# EAGLE board mdu29 (EAGLE 8.6.0)
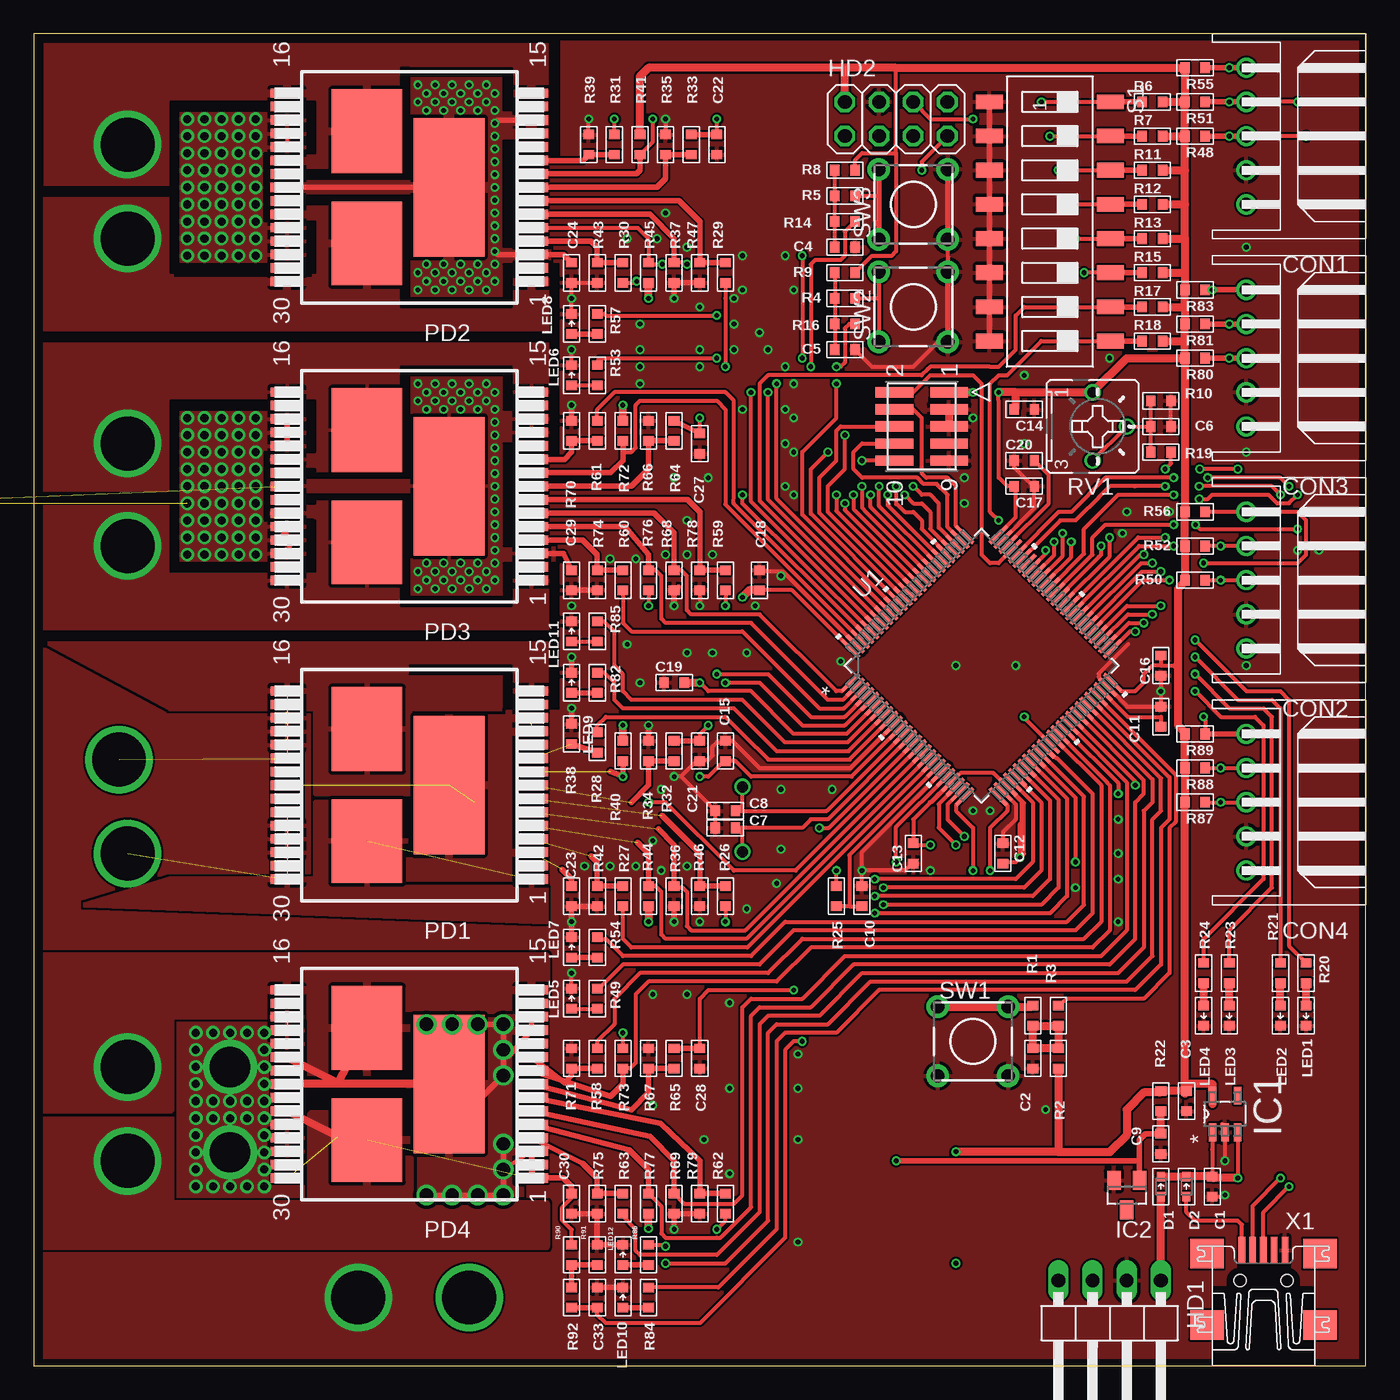
[diagram p3: board, top side]
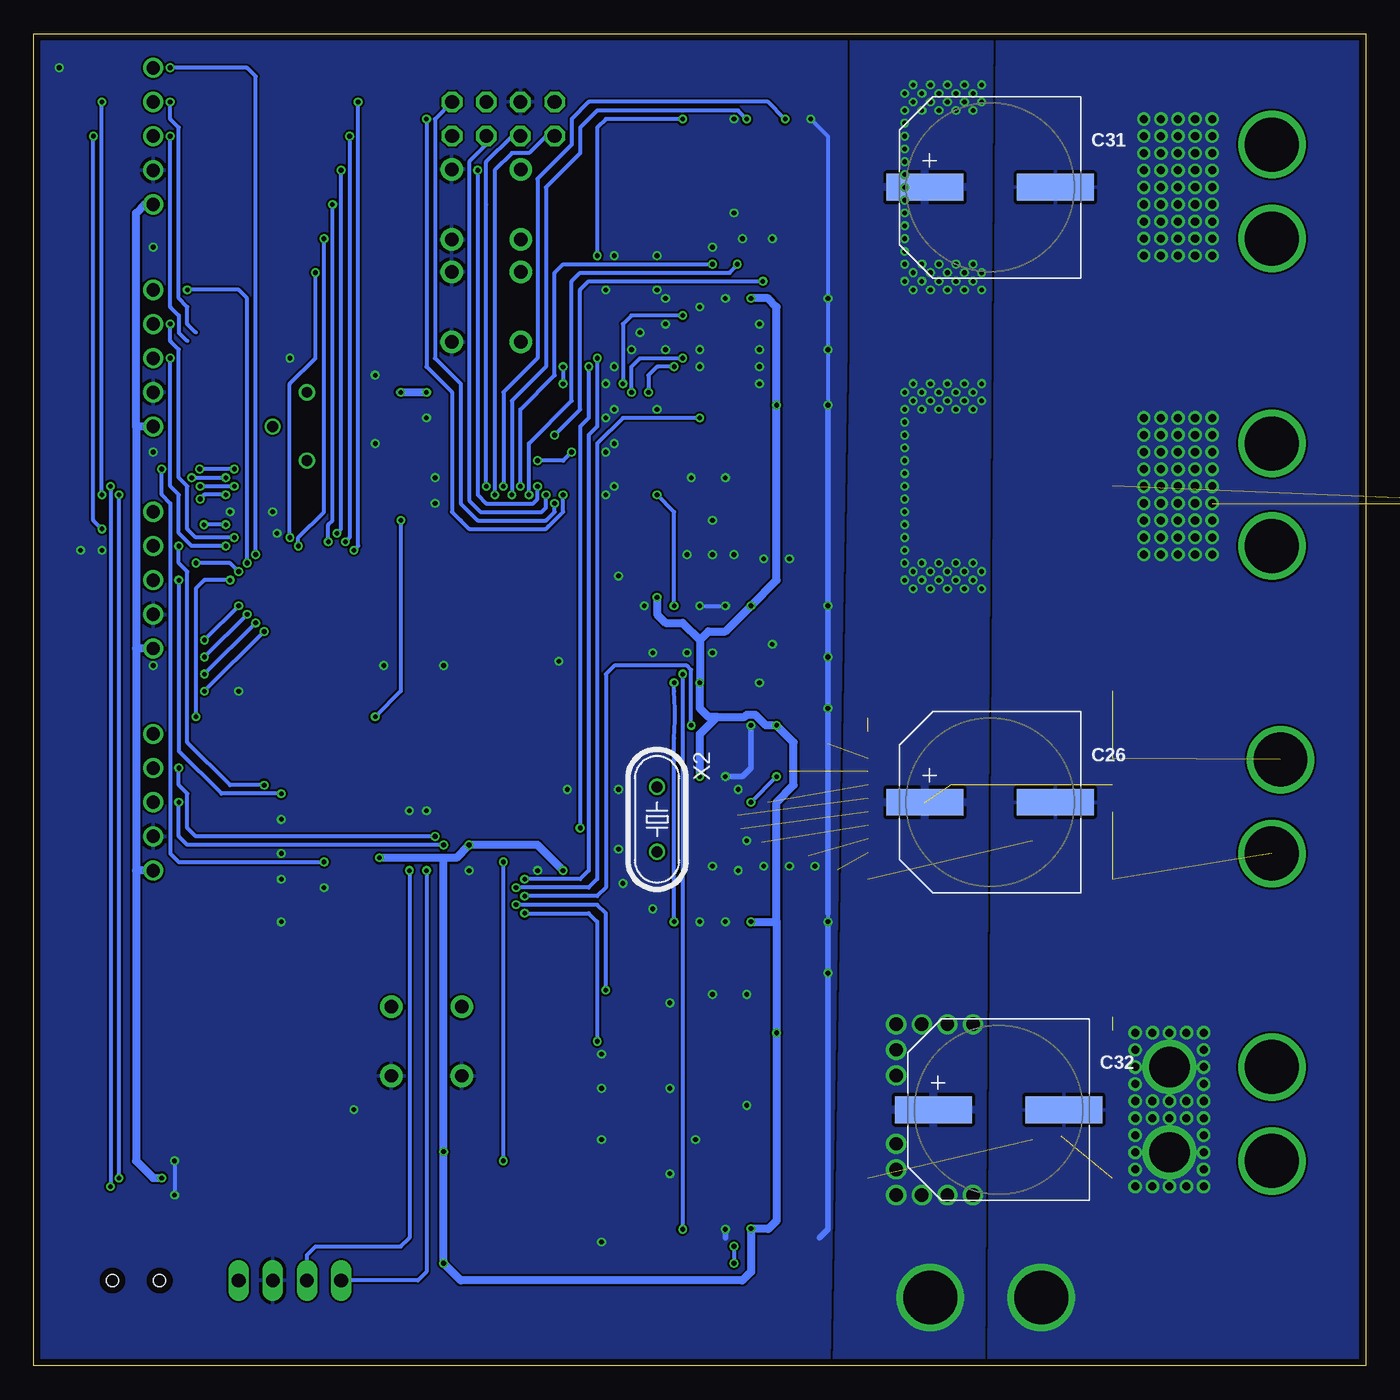
[diagram p4: board, bottom side, seen from below]

Size 99.06 x 99.06 mm. Coordinates in mm from the lower left corner, seen from the top.
Outline: 0,0 99.06,0 99.06,99.06 0,99.06 0,0
Copper layers (1*16): Top 0.035mm / dielectric 1.6mm / Bottom 0.035mm
Design rules "Elecrow_2-layer_PCB_eagle_rule": minimum track width 6mil, minimum drill 12mil, track to track 6mil, track to pad 6mil, pad to pad 6mil, via to via 8mil, smd to smd 0mil, copper to edge 20mil, drill to drill 10mil, minimum pad ring 6mil, minimum via ring 6mil, stop-mask expansion 0mil, vias tented up to drill 100mil, thermal gap 10mil
Net classes: 1 power: width 0.305 mm, drill 0.6 mm; 2 strong: width 0.406 mm, clearance 0.254 mm
tRestrict: area 0,81.3 to 21,94; area 17.1,85.1 to 27.9,96.5; area 0,87.6 to 39.1,99.1; area 34.9,83.2 to 39.1,93.3; area 0,0 to 39.1,87

## Footprints (pad centres in the part's own frame; a part is rotated, then mirrored left to right if it is on the bottom)
1608 = smd 0.7 x 0.8: 1 -0.75,0; 2 0.75,0
ES-12.5 = smd 5.7 x 2: N 4.85,0; P -4.85,0
5-L = drill 1: P$1 -5.08,0; P$2 -2.54,0; P$3 0,0; P$4 2.54,0; P$5 5.08,0
SOD523 = smd 0.7 x 0.6: A 0.75,0; K -0.75,0
1X4-L = drill 1.016 long: 1 -3.81,-3.81; 2 -1.27,-3.81; 3 1.27,-3.81; 4 3.81,-3.81
2X4-I = drill 1.016 octagon: 1 -3.81,-1.27; 2 -3.81,1.27; 3 -1.27,-1.27; 4 -1.27,1.27; 5 1.27,-1.27; 6 1.27,1.27; 7 3.81,-1.27; 8 3.81,1.27
SOT95P270X145-5N = smd 1.321 x 0.559: 1 -1.372,0.94; 2 -1.372,0; 3 -1.372,-0.94; 4 1.372,-0.94; 5 1.372,0.94
SOT23 = smd 1 x 1.4: 1 -0.95,-1.1; 2 0.95,-1.1; 3 0,1.1
CON10_2X5_DUK_FTSH = smd 0.762 x 2.794: 1 2.54,-2.032; 2 2.54,2.032; 3 1.27,-2.032; 4 1.27,2.032; 5 0,-2.032; 6 0,2.032; 7 -1.27,-2.032; 8 -1.27,2.032; 9 -2.54,-2.032; 10 -2.54,2.032
1608' = smd 0.7 x 0.8: A 0.75,0; K -0.75,0
VNH5019 = smd 2.4 x 0.7: 1 1.06,-1.89; 2 1.06,-2.89; 3 1.06,-3.89; 4 1.06,-4.89; 5 1.06,-5.89; 6 1.06,-6.89; 7 1.06,-7.89; 8 1.06,-8.89; 9 1.06,-9.89; 10 1.06,-10.89; 11 1.06,-11.89; 12 1.06,-12.89; 13 1.06,-13.89; 14 1.06,-14.89; 15 1.06,-15.89; 16 19.26,-15.89; 17 19.26,-14.89; 18 19.26,-13.89; 19 19.26,-12.89; 20 19.26,-11.89; 21 19.26,-10.89; 22 19.26,-9.89; 23 19.26,-8.89; 24 19.26,-7.89; 25 19.26,-6.89; 26 19.26,-5.89; 27 19.26,-4.89; 28 19.26,-3.89; 29 19.26,-2.89; 30 19.26,-1.89 | smd 5.25 x 6.23: OUTA#PAD 13.31,-4.725; OUTB#PAD 13.31,-13.055 | smd 5.25 x 10.3: VCC#PAD 7.21,-8.89
RV = drill 0.8: 1 -2.54,0; 2 0,2.54; 3 2.54,0
SMS-008 = smd 1.092 x 2.007: 1 -8.89,-4.496; 2 -6.35,-4.496; 3 -3.81,-4.496; 4 -1.27,-4.496; 5 1.27,-4.496; 6 3.81,-4.496; 7 6.35,-4.496; 8 8.89,-4.496; 9 8.89,4.496; 10 6.35,4.496; 11 3.81,4.496; 12 1.27,4.496; 13 -1.27,4.496; 14 -3.81,4.496; 15 -6.35,4.496; 16 -8.89,4.496
PUSHSW-1 = drill 1 pad 1.676: 1-1 -2.615,2.567; 1-2 2.615,2.567; 2-1 -2.615,-2.567; 2-2 2.615,-2.567
LQFP-100-M = smd 1.778 x 0.279: 1 -7.772,6; 2 -7.772,5.5; 3 -7.772,5; 4 -7.772,4.5; 5 -7.772,4; 6 -7.772,3.5; 7 -7.772,3; 8 -7.772,2.5; 9 -7.772,2; 10 -7.772,1.5; 11 -7.772,1; 12 -7.772,0.5; 13 -7.772,0; 14 -7.772,-0.5; 15 -7.772,-1; 16 -7.772,-1.5; 17 -7.772,-2; 18 -7.772,-2.5; 19 -7.772,-3; 20 -7.772,-3.5; 21 -7.772,-4; 22 -7.772,-4.5; 23 -7.772,-5; 24 -7.772,-5.5; 25 -7.772,-6; 51 7.772,-6; 52 7.772,-5.5; 53 7.772,-5; 54 7.772,-4.5; 55 7.772,-4; 56 7.772,-3.5; 57 7.772,-3; 58 7.772,-2.5; 59 7.772,-2; 60 7.772,-1.5; 61 7.772,-1; 62 7.772,-0.5; 63 7.772,0; 64 7.772,0.5; 65 7.772,1; 66 7.772,1.5; 67 7.772,2; 68 7.772,2.5; 69 7.772,3; 70 7.772,3.5; 71 7.772,4; 72 7.772,4.5; 73 7.772,5; 74 7.772,5.5; 75 7.772,6 | smd 0.279 x 1.778: 26 -6,-7.772; 27 -5.5,-7.772; 28 -5,-7.772; 29 -4.5,-7.772; 30 -4,-7.772; 31 -3.5,-7.772; 32 -3,-7.772; 33 -2.5,-7.772; 34 -2,-7.772; 35 -1.5,-7.772; 36 -1,-7.772; 37 -0.5,-7.772; 38 0,-7.772; 39 0.5,-7.772; 40 1,-7.772; 41 1.5,-7.772; 42 2,-7.772; 43 2.5,-7.772; 44 3,-7.772; 45 3.5,-7.772; 46 4,-7.772; 47 4.5,-7.772; 48 5,-7.772; 49 5.5,-7.772; 50 6,-7.772; 76 6,7.772; 77 5.5,7.772; 78 5,7.772; 79 4.5,7.772; 80 4,7.772; 81 3.5,7.772; 82 3,7.772; 83 2.5,7.772; 84 2,7.772; 85 1.5,7.772; 86 1,7.772; 87 0.5,7.772; 88 0,7.772; 89 -0.5,7.772; 90 -1,7.772; 91 -1.5,7.772; 92 -2,7.772; 93 -2.5,7.772; 94 -3,7.772; 95 -3.5,7.772; 96 -4,7.772; 97 -4.5,7.772; 98 -5,7.772; 99 -5.5,7.772; 100 -6,7.772
UX60-MB-5ST = smd 2 x 0.5: 1 2.25,1.6; 2 2.25,0.8; 3 2.25,0; 4 2.25,-0.8; 5 2.25,-1.6 | smd 2.2 x 2.5: M1 -3.3,-4.2; M2 -3.3,4.2; M3 2,4.2; M4 2,-4.2 | hole 0.9: 0,-1.75; 0,1.75
XTAL = drill 0.813: 1 -2.413,0; 2 2.413,0

## Placement (x,y rotation side)
C1  1uF  [1608]  87.63,13.34 270 top
C2  0.1uF  [1608]  74.3,22.86 90 top
C3  1uF  [1608]  85.72,19.68 270 top
C4  0.1uF  [1608]  60.33,83.19 180 top
C5  0.1uF  [1608]  60.33,75.56 180 top
C6  0.1uF  [1608]  83.82,69.85 180 top
C7  22p  [1608]  51.44,40.01 0 top
C8  22p  [1608]  51.44,41.27 0 top
C9  0.1uF  [1608]  83.82,16.51 90 top
C10  0.1uF  [1608]  61.59,34.92 270 top
C11  2.2uF  [1608]  83.82,48.26 270 top
C12  0.1uF  [1608]  72.07,38.1 270 top
C13  0.1uF  [1608]  65.41,38.1 90 top
C14  0.1uF  [1608]  73.66,71.12 180 top
C15  0.1uF  [1608]  51.44,45.72 270 top
C16  0.1uF  [1608]  83.82,52.07 90 top
C17  0.1uF  [1608]  73.66,65.41 180 top
C18  0.1uF  [1608]  53.98,58.42 270 top
C19  0.1uF  [1608]  47.62,50.8 0 top
C20  2.2uF  [1608]  73.66,67.31 0 top
C21  1000pF  [1608]  49.53,45.72 270 top
C22  1000pF  [1608]  50.8,90.81 270 top
C23  0.1uF  [1608]  40.01,34.92 270 top
C24  0.1uF  [1608]  40.01,81.28 270 top
C25  220uF  [ES-12.5]  -17.14,64.14 0 bottom  (outside the outline)
C26  220uF  [ES-12.5]  27.94,41.91 0 bottom
C27  1000pF  [1608]  49.53,68.58 270 top
C28  1000pF  [1608]  49.53,22.86 270 top
C29  0.1uF  [1608]  40.01,58.42 270 top
C30  0.1uF  [1608]  40.01,12.06 270 top
C31  220uF  [ES-12.5]  27.94,87.63 0 bottom
C32  220uF  [ES-12.5]  27.3,19.05 0 bottom
C33  1000pF  [1608]  41.91,5.08 90 top
CON1  [5-L]  90.17,91.44 90 top
CON2  [5-L]  90.17,58.42 90 top
CON3  [5-L]  90.17,74.93 90 top
CON4  [5-L]  90.17,41.91 90 top
D1  [SOD523]  83.82,13.34 270 top
D2  [SOD523]  85.72,13.34 270 top
HD1  [1X4-L]  80.01,2.54 180 top
HD2  [2X4-I]  64.14,92.71 0 top
IC1  MIC5504  [SOT95P270X145-5N]  88.58,18.73 90 top
IC2  LM4040  [SOT23]  81.28,12.7 180 top
J1  FTSH-105-01-L-DV-K-TR  [CON10_2X5_DUK_FTSH]  66.04,69.85 90 top
LED1  [1608']  94.61,26.04 90 top
LED2  [1608']  92.71,26.04 90 top
LED3  [1608']  88.9,26.04 90 top
LED4  [1608']  87,26.04 90 top
LED5  [1608']  40.01,27.3 270 top
LED6  [1608']  40.01,73.66 270 top
LED7  [1608']  40.01,31.11 270 top
LED8  [1608']  40.01,77.47 270 top
LED9  [1608']  40.01,50.8 270 top
LED10  [1608']  43.81,5.08 270 top
LED11  [1608']  40.01,54.61 270 top
LED12  [1608']  43.81,8.26 270 top
PD1  VNH5019  [VNH5019]  38.1,34.29 180 top
PD2  VNH5019  [VNH5019]  38.1,78.74 180 top
PD3  VNH5019  [VNH5019]  38.1,56.52 180 top
PD4  VNH5019  [VNH5019]  38.1,12.06 180 top
R1  330ohm  [1608]  74.3,26.04 270 top
R2  10k  [1608]  76.2,22.86 90 top
R3  1kohm  [1608]  76.2,26.04 90 top
R4  330ohm  [1608]  60.33,79.38 180 top
R5  330ohm  [1608]  60.33,87 180 top
R6  10k  [1608]  83.19,93.98 0 top
R7  10k  [1608]  83.19,91.44 0 top
R8  10k  [1608]  60.33,88.9 180 top
R9  10k  [1608]  60.33,81.28 180 top
R10  330  [1608]  83.82,71.75 0 top
R11  10k  [1608]  83.19,88.9 0 top
R12  10k  [1608]  83.19,86.36 0 top
R13  10k  [1608]  83.19,83.82 0 top
R14  1kohm  [1608]  60.33,85.09 0 top
R15  10k  [1608]  83.19,81.28 0 top
R16  1kohm  [1608]  60.33,77.47 0 top
R17  10k  [1608]  83.19,78.74 0 top
R18  10k  [1608]  83.19,76.2 0 top
R19  1kohm  [1608]  83.82,67.94 0 top
R20  330ohm  [1608]  94.61,29.21 90 top
R21  330ohm  [1608]  92.71,29.21 90 top
R22  100  [1608]  83.82,19.68 270 top
R23  330ohm  [1608]  88.9,29.21 90 top
R24  330ohm  [1608]  87,29.21 90 top
R25  100  [1608]  59.69,34.92 90 top
R26  10ohm  [1608]  51.44,34.92 90 top
R27  10ohm  [1608]  43.81,34.92 90 top
R28  10ohm  [1608]  41.91,46.35 270 top
R29  10ohm  [1608]  51.44,81.28 90 top
R30  10ohm  [1608]  43.81,81.28 90 top
R31  10ohm  [1608]  43.18,90.81 270 top
R32  3.9kohm  [1608]  47.62,45.72 90 top
R33  3.9kohm  [1608]  48.9,90.81 90 top
R34  820ohm  [1608]  45.72,45.72 270 top
R35  820ohm  [1608]  46.99,90.81 270 top
R36  47kohm  [1608]  47.62,34.92 90 top
R37  47kohm  [1608]  47.62,81.28 90 top
R38  47kohm  [1608]  40.01,46.99 270 top
R39  47kohm  [1608]  41.27,90.81 270 top
R40  47kohm  [1608]  43.81,45.72 90 top
R41  47kohm  [1608]  45.09,90.81 90 top
R42  47kohm  [1608]  41.91,34.92 90 top
R43  47kohm  [1608]  41.91,81.28 90 top
R44  47kohm  [1608]  45.72,34.92 270 top
R45  47kohm  [1608]  45.72,81.28 270 top
R46  47kohm  [1608]  49.53,34.92 90 top
R47  47kohm  [1608]  49.53,81.28 90 top
R48  10[khom]  [1608]  86.36,91.44 180 top
R49  330ohm  [1608]  41.91,27.3 90 top
R50  10[khom]  [1608]  86.36,58.42 180 top
R51  10kohm  [1608]  86.36,93.98 180 top
R52  10kohm  [1608]  86.36,60.96 180 top
R53  330ohm  [1608]  41.91,73.66 90 top
R54  330ohm  [1608]  41.91,31.11 90 top
R55  10kohm  [1608]  86.36,96.52 180 top
R56  10kohm  [1608]  86.36,63.5 180 top
R57  330ohm  [1608]  41.91,77.47 90 top
R58  10ohm  [1608]  41.91,22.86 270 top
R59  10ohm  [1608]  51.44,58.42 90 top
R60  10ohm  [1608]  43.81,58.42 90 top
R61  10ohm  [1608]  41.91,69.53 270 top
R62  10ohm  [1608]  51.44,12.06 90 top
R63  10ohm  [1608]  43.81,12.06 90 top
R64  3.9kohm  [1608]  47.62,69.53 90 top
R65  3.9kohm  [1608]  47.62,22.86 90 top
R66  820ohm  [1608]  45.72,69.53 270 top
R67  820ohm  [1608]  45.72,22.86 270 top
R68  47kohm  [1608]  47.62,58.42 90 top
R69  47kohm  [1608]  47.62,12.06 90 top
R70  47kohm  [1608]  40.01,69.53 270 top
R71  47kohm  [1608]  40.01,22.86 270 top
R72  47kohm  [1608]  43.81,69.53 90 top
R73  47kohm  [1608]  43.81,22.86 90 top
R74  47kohm  [1608]  41.91,58.42 90 top
R75  47kohm  [1608]  41.91,12.06 90 top
R76  47kohm  [1608]  45.72,58.42 270 top
R77  47kohm  [1608]  45.72,12.06 270 top
R78  47kohm  [1608]  49.53,58.42 90 top
R79  47kohm  [1608]  49.53,12.06 90 top
R80  10[khom]  [1608]  86.36,74.93 180 top
R81  10kohm  [1608]  86.36,77.47 180 top
R82  330  [1608]  41.91,50.8 90 top
R83  10kohm  [1608]  86.36,80.01 180 top
R84  330  [1608]  45.72,5.08 90 top
R85  330  [1608]  41.91,54.61 90 top
R86  330  [1608]  45.72,8.26 90 top
R87  10[khom]  [1608]  86.36,41.91 180 top
R88  10kohm  [1608]  86.36,44.45 180 top
R89  10kohm  [1608]  86.36,46.99 180 top
R90  11kohm  [1608]  40.01,8.26 90 top
R91  1kohm  [1608]  41.91,8.26 270 top
R92  3kohm  [1608]  40.01,5.08 90 top
RV1  10k B  [RV]  78.74,69.85 270 top
S1  SWS008  [SMS-008]  75.56,85.09 270 top
SW1  [PUSHSW-1]  69.85,24.13 0 top
SW2  [PUSHSW-1]  65.41,78.74 90 top
SW3  [PUSHSW-1]  65.41,86.36 90 top
U1  STM32F401VCT6LQFP-100-M  [LQFP-100-M]  70.48,52.07 45 top
X1  MINI-USB-UX60-MB-5ST  [UX60-MB-5ST]  91.44,6.35 90 top
X2  8MHz  [XTAL]  52.7,40.64 270 bottom

## Tracks (layer width: path | path; a pad name or v marks a point on that pad's centre or on a via)
+3V3  (via drill 0.35)
  Top 0.305: 87.64,19.48 IC1.5 | U1.50 80.88,50.16 81.92,50.16 82.55,50.8 82.55,51.44 83.19,52.07 83.82,52.07 | 83.7,52.7 C16.2 83.82,52.07 | 83.82,52.07 84.97,52.07 | 73.62,41.87 U1.28 72.38,43.11 72.32,43.11 | 73.62,41.87 73.66,41.82 | 67.19,42.42 67.32,42.54 | 67.32,42.54 U1.22 | U1.11 60.82,43.81 53.34,43.81 52.19,44.97 C15.2 51.32,44.97 50.16,43.81 v49.53,43.81 | 67.32,42.54 67.3,42.54 65.41,40.64 C13.2 65.52,38.73 v66.67,38.73 | R25.2 v59.69,36.83 | U1.75 73.03,63.09 73.03,65.29 C17.2 72.39,65.41 71.75,66.04 71.75,71.75 71.75,71.76 v71.75,72.39 | 60.96,89.02 R8.1 61.08,89.65 61.59,90.17 64.14,90.17 | C18.2 56.4,57.67 U1.100 | R76.2 v45.72,56.52 | U1.6 60.45,46.99 56.52,46.99 53.34,50.16 50.16,50.16 v49.53,50.8 | R73.2 v43.81,24.77 | C12.2 71.87,37.47 73.03,37.47 v73.34,37.78 | v73.34,37.78 73.66,38.1 73.62,38.14 73.62,41.87 | v73.34,37.78 73.34,40.31 73.48,40.45 73.48,41.94 72.32,43.11 | 66.63,41.91 66.75,41.91 68.91,44.07 71.35,44.07 72.32,43.11 | R9.1 62.34,82.55 63.82,82.55 64.14,82.87 64.14,90.17 | 64.14,90.17 64.14,96.52 | C3.1 85.61,20.32 85.61,20.23
  Top 0.61: R48.2 R51.2 | R51.2 R55.2 64.14,96.52 60.33,96.52 | R80.2 85.61,76.2 | 85.61,76.2 R81.2 85.61,78.74 | 85.61,78.74 R83.2 85.61,81.28 | 85.61,86.36 85.61,88.9 | 85.61,83.82 85.61,81.28 | 85.61,83.82 85.61,86.36 | 85.61,88.9 R48.2 | R80.2 R56.2 R52.2 R50.2 85.61,58.3 85.09,57.78 85.09,51.95 | R41.2 45.09,95.89 45.72,96.52 60.33,96.52 | R6.2 R51.2 | R7.2 R48.2 | R11.2 85.61,88.9 | R12.2 85.61,86.36 | R15.2 85.61,81.28 | R17.2 85.61,78.74 | R18.2 85.61,76.2 | R13.2 85.61,83.82 | 85.61,20.95 R87.2 R88.2 R89.2 85.61,47.1 85.09,47.62 85.09,51.95 | 85.61,20.23 85.61,20.95 | J1.1 v69.85,72.39 | 73.03,72.39 v71.75,72.39 | 73.03,72.39 RV1.1 81.28,74.93 R80.2 | HD2.2 60.33,96.52 | v45.72,79.38 R45.2 | R72.2 v43.81,71.44 | R40.2 v43.81,47.62 | R44.2 v45.72,33.02 | v45.72,10.21 R77.2 | C19.2 v49.53,50.8 | C18.2 53.23,57.67 v52.7,57.15 | C14.2 73.03,71.23 73.03,72.39 | 87.64,20.75 87.64,19.48 | IC1.5 87.64,20.95 85.61,20.95 | C3.1 R22.1 83.7,20.32 82.55,20.32 81.28,19.05 81.28,17.14 80.03,15.9 76.2,15.9 | v68.58,15.92 68.6,15.9 76.2,15.9 | R2.1 76.2,15.9 | 85.09,51.95 84.97,52.07
  Bottom 0.305: 68.58,37.78 67.63,37.78
  Bottom 0.61: v69.85,72.39 v71.75,72.39 71.84,72.39 | 43.81,33.02 v43.81,24.77 43.81,10.79 44.42,10.19 45.72,10.19 v45.72,10.21 45.72,6.99 46.35,6.35 67.31,6.35 v68.58,7.62 v68.58,15.92 68.58,37.78 | 43.81,33.02 43.81,41.91 42.55,43.18 42.55,46.35 v43.81,47.62 44.61,47.62 45.4,48.41 46.05,48.41 46.2,48.26 48.26,48.26 | v45.72,79.38 44.45,79.38 43.81,78.74 v43.81,71.44 43.81,58.42 v45.72,56.52 47.62,54.61 48.9,54.61 49.53,53.98 | v45.72,33.02 43.81,33.02 | 48.26,48.26 48.9,48.26 49.53,48.9 v49.53,50.8 49.53,53.98 | v52.7,57.15 52.7,55.88 52.07,55.24 50.8,55.24 49.53,53.98 | v59.69,36.83 61.59,38.73 v66.67,38.73 67.63,37.78 v73.34,37.78 | v49.53,43.81 49.53,46.99 48.26,48.26
+5V  (via drill 0.35)
  Top 0.305: IC1.1 87.63,16.09 C1.1 | IC1.3 89.52,13.98 v89.53,13.97
  Top 0.61: D1.K D2.K C1.1 87.75,13.97 v89.53,13.97
  Bottom 0.61: CON1.P$1 90.81,86.36 91.44,85.72 91.44,69.85 | CON4.P$1 91.44,36.83 | 91.44,69.85 91.44,53.34 | 91.44,53.34 91.44,36.83 | CON2.P$1 91.44,53.34 | CON3.P$1 91.44,69.85 | v89.53,13.97 90.17,13.97 91.44,15.24 91.44,36.83
A1  (via drill 0.35)
  Top 0.305: U1.88 59.05,63.5 59.05,65.41 60.33,66.67 v60.33,69.22 | R30.1 44.73,80.53 v44.84,80.64
  Bottom 0.305: 44.77,80.64 v44.84,80.64 57.78,80.64 58.42,80.01 58.42,71.12 v60.33,69.22
A2
  Top 0.305: R60.1 43.81,55.24 44.45,54.61 52.7,54.61 58.42,48.9 60.24,48.9 U1.3
A3
  Top 0.305: U1.18 53.07,31.11 44.45,31.11 43.81,31.75 R27.1
A4
  Top 0.305: U1.44 83.19,43.61 83.19,41.91 82.55,41.27 82.55,31.11 80.64,29.21 61.59,29.21 58.42,26.04 54.61,26.04 53.98,25.4 53.98,11.43 50.8,8.26 45.09,8.26 44.77,8.57 44.77,10.16 43.81,11.11 R63.1
B1  (via drill 0.35)
  Top 0.305: R31.1 v43.18,92.71 | v64.14,65.41 64.14,64.08 64.19,64.08 64.77,63.5 65.41,63.5 66.04,62.87 66.04,62.23 66.22,62.05 66.22,62.04 67.82,60.44 U1.80
  Bottom 0.305: v43.18,92.71 44.45,93.98 57.78,93.98 59.05,92.71 59.05,90.81 61.59,88.27 61.59,74.93 64.14,72.39 v64.14,65.41
B2
  Top 0.305: R61.1 41.91,71.12 43.18,72.39 51.44,72.39 52.07,71.75 52.07,64.77 52.06,64.14 U1.97
B3
  Top 0.305: R28.1 41.91,47.62 42.55,48.26 51.44,48.26 52.77,46.93 52.78,46.93 54.62,45.09 60.67,45.09 U1.9
B4
  Top 0.305: U1.38 79.38,43.18 79.38,33.02 78.11,31.75 57.15,31.75 54.61,29.21 45.09,29.21 43.18,27.3 43.18,25.4 41.91,24.13 R58.1
BATERR  (via drill 0.35)
  Top 0.305: U1.51 81.51,54.61 v81.92,54.61 | v86.36,50.16 88.27,48.26 90.81,48.26 91.44,47.62 91.44,36.2 87,31.75 R24.2
  Bottom 0.305: v81.92,54.61 v86.36,50.16
BATSTA  (via drill 0.35)
  Top 0.305: U1.52 81.44,55.24 v82.55,55.24 | v86.36,51.44 88.9,48.9 91.44,48.9 92.08,48.26 92.08,35.56 88.9,32.38 R23.2
  Bottom 0.305: v82.55,55.24 v86.36,51.44
BOOT0@SYS
  Top 0.305: 81.28,78.74 73.66,78.74 73.03,78.11 73.03,75.56 71.75,74.3 71.12,74.3 71.11,74.29 71.11,74.3 66.67,74.3 66.5,74.12 66.49,74.12 66.03,73.66 54.61,73.66 53.98,73.03 53.98,64.34 U1.94
  Top 0.406: R17.1 81.28,78.74 S1.10
BOOT1@SYS  (via drill 0.35)
  Top 0.305: v71.75,62.87 71.12,63.5 71.12,73.03 71.75,73.66 72.39,73.66 74.93,76.2 S1.9 | v73.66,48.26 73.66,48.19 U1.37
  Top 0.406: S1.9 R18.1
  Bottom 0.305: v71.75,62.87 71.75,50.16 v73.66,48.26
C1@ANA  (via drill 0.35)
  Top 0.305: C22.1 v50.8,92.71 | U1.29 74.3,41.9 74.3,37.47 73.03,36.2 v62.55,36.2 | v57.15,82.55 v57.15,74.93
  Top 0.406: R33.2 C22.1
  Bottom 0.305: v50.8,92.71 56.52,92.71 57.15,92.08 v57.15,82.55 | v62.55,36.2 58.42,36.2 57.78,36.83 57.78,69.22 57.15,69.85 v57.15,74.93
C2@ANA  (via drill 0.35)
  Top 0.305: C27.1 v49.53,70.48 | U1.30 73.15,43.69 74.93,41.91 74.93,36.83 73.66,35.56 v63.18,35.56
  Top 0.406: R64.2 C27.1
  Bottom 0.305: v49.53,70.48 55.24,70.48 57.15,68.58 57.15,36.2 57.78,35.56 v63.18,35.56
C3@ANA  (via drill 0.35)
  Top 0.305: 73.51,44.04 U1.31 75.56,42.04 75.56,36.2 74.3,34.92 v62.55,34.92 | C21.1 49.53,46.99 v50.16,47.62
  Top 0.406: R32.2 C21.1
  Bottom 0.305: v50.16,47.62 50.16,51.75 50.48,52.07 55.88,52.07 56.52,51.44 56.52,35.56 57.15,34.92 v62.55,34.92
C4@ANA  (via drill 0.35)
  Top 0.305: U1.32 76.2,42.11 76.2,35.56 74.93,34.29 v63.18,34.29 | C28.1 49.53,27.3 50.16,27.94 v56.52,27.94
  Top 0.406: R65.2 C28.1
  Bottom 0.305: v56.52,27.94 56.52,33.66 57.15,34.29 v63.18,34.29
CD1  (via drill 0.35)
  Top 0.305: 44.45,85.63 44.66,85.63 | U1.82 62.87,63.93 v62.87,65.41 | v48.58,81.92 48.46,82.03 R37.2
  Top 0.406: PD2.6 44.45,85.63 45.81,85.63 47.62,83.82 R37.2
  Bottom 0.305: v62.87,65.41 62.87,71.12 60.33,73.66 60.33,81.28 59.69,81.92 v48.58,81.92
CD2
  Top 0.305: U1.1 60.09,50.16 59.69,50.16 53.98,55.88 48.9,55.88 48.58,56.2 48.58,58.74 48.15,59.17 R68.2
  Top 0.406: PD3.6 46.13,63.41 47.62,61.91 R68.2
CD3  (1 unrouted)
  Top 0.305: U1.16 52.92,32.38 48.9,32.38 48.58,32.7 48.58,35.24 48.26,35.56 47.74,35.56 R36.2
  Top 0.406: 46.45,39.91 47.62,38.73 R36.2
CD4
  Top 0.305: R69.2 48.38,12.06 52.07,12.06 52.7,12.7 52.7,26.67 53.34,27.3 57.15,27.3 60.33,30.48 79.38,30.48 81.28,32.38 81.28,43.4 U1.41
  Top 0.406: PD4.6 45.81,17.05 47.62,15.24 R69.2
CLKIN
  Top 0.305: U1.12 58.98,41.27 52.7,41.27 | 52.7,41.27 X2.1 | C8.2 52.7,41.27
CLKOUT
  Top 0.305: X2.2 52.7,40.01 C7.2 57.15,40.01 57.78,40.64 59.05,40.64 U1.13
CTS2@UART  (via drill 0.35)
  Top 0.305: HD2.7 66.04,89.53 v66.04,88.9 | U1.84 61.88,63.5 61.59,63.82 v61.59,65.41
  Bottom 0.305: v66.04,88.9 66.04,64.77 65.41,64.14 61.91,64.14 61.59,64.45 v61.59,65.41
DM@USB  (via drill 0.35)
  Top 0.305: X1.2 90.64,11.9 v92.71,13.97 | v92.71,64.77 92.08,65.41 v86.68,65.41 | v84.14,65.41 81.92,65.41 | 81.92,65.41 81.86,65.4 | 81.92,65.41 80.01,65.41 79.2,64.59 79.2,64.58 77.66,63.04 77.65,63.04 77.47,62.87 76.33,62.87 U1.70
  Bottom 0.305: v86.68,65.41 v84.14,65.41 | v92.71,13.97 v92.71,64.77
DP@USB  (via drill 0.35)
  Top 0.305: X1.3 91.44,11.43 v93.34,13.34 | v93.34,65.41 92.71,66.04 v87.31,66.04 | v84.77,66.04 79.69,66.04 77.15,63.5 76.2,63.5 U1.71
  Bottom 0.305: v87.31,66.04 v84.77,66.04 | v93.34,65.41 v93.34,13.34
EA1  (via drill 0.35)
  Top 0.305: U1.83 62.23,63.86 v62.23,64.77 | v46.74,81.92 45.84,81.92 R45.1 45.72,83.82 44.91,84.63 PD2.5
  Bottom 0.305: v62.23,64.77 62.23,68.58 59.05,71.75 59.05,80.64 58.42,81.28 47.31,81.28 46.67,81.92 v46.74,81.92
EA2
  Top 0.305: U1.2 60.17,49.53 59.05,49.53 53.34,55.24 46.99,55.24 46.67,55.56 46.67,58.74 46.24,59.17 R76.1
  Top 0.406: PD3.5 43.96,62.41 45.72,60.33 R76.1
EA3  (1 unrouted)
  Top 0.305: U1.17 52.99,31.75 46.99,31.75 46.67,32.07 46.67,35.24 46.24,35.67 R44.1
  Top 0.406: R44.1 45.72,38.1 44.91,38.91
EA4
  Top 0.305: R77.1 46.67,11.86 46.67,9.84 46.99,9.53 50.79,9.53 51.06,9.53 53.34,11.81 53.34,26.04 53.98,26.67 57.78,26.67 60.96,29.84 80.01,29.84 81.92,31.75 81.92,41.91 82.55,42.55 82.55,43.54 U1.43
  Top 0.406: R77.1 45.72,14.61 44.27,16.05 PD4.5
EB1  (via drill 0.35)
  Top 0.305: R41.1 46.04,91.01 v46.04,92.71 | v63.5,64.77 63.5,64 U1.81
  Top 0.406: R41.1 45.09,88.9 44.81,88.63 PD2.9
  Bottom 0.305: v46.04,92.71 46.67,93.34 57.15,93.34 58.42,92.08 58.42,90.17 60.96,87.63 60.96,74.3 63.5,71.75 v63.5,64.77
EB2
  Top 0.305: 43.81,67.31 43.81,67.63 | R72.1 43.93,67.94 44.45,67.94 44.77,68.26 44.77,71.44 45.09,71.75 50.8,71.75 51.44,71.12 51.44,64.05 U1.98
  Top 0.406: R72.1 43.81,67.31 42.91,66.41 PD3.9
EB3  (via drill 0.35)  (1 unrouted)
  Top 0.305: U1.15 56.66,36.83 52.07,36.83 46.99,41.91 v45.72,41.91
  Top 0.406: R40.1 v43.81,43.81 42.91,44.18
  Bottom 0.305: v45.72,41.91 v43.81,43.81
EB4
  Top 0.305: U1.39 76.33,46.87 79.83,43.37 79.83,43.36 80.01,43.18 80.01,32.38 78.74,31.11 57.78,31.11 55.24,28.57 45.72,28.57 44.77,27.62 44.77,22.54 44.34,22.11 R73.1
  Top 0.406: PD4.9 42.91,20.05 43.81,20.95 R73.1
EIO0  (via drill 0.35)
  Top 0.305: v64.77,64.77 65.41,64.14 66.04,64.14 66.67,63.5 66.67,62.23 68.58,60.33 68.58,60.34 U1.79
  Bottom 0.305: HD2.1 60.96,91.44 62.23,90.17 63.5,90.17 64.77,88.9 v64.77,64.77
EIO1  (via drill 0.35)
  Top 0.305: U1.78 67.31,62.32 67.31,64.14 66.67,64.77 66.04,64.77 v65.41,65.41
  Bottom 0.305: HD2.3 63.5,91.44 65.41,89.53 65.41,86.36 v65.41,65.41
ENCL1  (via drill 0.35)
  Top 0.305: R57.2 42.43,78.22 42.55,78.11 v50.8,78.11 | U1.92 55.24,64.48 v55.24,73.03
  Bottom 0.305: v50.8,78.11 54.61,78.11 55.24,77.47 v55.24,73.03
ENCL2
  Top 0.305: U1.7 60.53,46.35 55.88,46.35 52.7,49.53 44.45,49.53 43.81,50.16 43.81,51.44 43.18,52.07 43.18,54.61 42.43,55.36 R85.2
ENCL3
  Top 0.305: R54.2 42.02,31.75 42.55,31.75 43.81,30.48 53.34,30.48 55.88,33.02 76.83,33.02 78.11,34.29 78.11,42.33 U1.35
ENCL4  (via drill 0.35)
  Top 0.305: R86.2 46.88,9.01 v46.99,8.89 | v46.99,7.62 51.44,7.62 54.61,10.79 54.61,24.77 55.24,25.4 59.05,25.4 62.23,28.57 81.28,28.57 83.19,30.48 83.19,40.64 83.82,41.27 83.82,43.69 U1.45
  Bottom 0.305: v46.99,8.89 v46.99,7.62
ERR1  (via drill 0.35)
  Top 0.305: R53.2 42.02,74.93 v50.8,74.93 | U1.93 54.61,64.41 v54.61,72.39
  Bottom 0.305: v54.61,72.39 54.61,74.3 53.98,74.93 v50.8,74.93
ERR2
  Top 0.305: U1.8 60.6,45.72 55.24,45.72 52.07,48.9 43.81,48.9 43.18,49.53 43.18,50.8 42.43,51.55 R82.2
ERR3
  Top 0.305: U1.36 75.33,45.87 76.01,45.19 76.1,45.19 78.74,42.55 78.74,33.66 77.47,32.38 56.52,32.38 53.98,29.84 43.81,29.84 42.02,28.05 R49.2
ERR4
  Top 0.305: U1.46 84.45,43.76 84.45,41.91 84.45,40.64 83.82,40.01 83.82,29.84 81.92,27.94 62.87,27.94 59.69,24.77 55.88,24.77 55.24,24.13 55.24,10.16 50.91,5.83 R84.2
GND  (via drill 0.35, 0.6 pad 1, 3 pad 1, 4)  (2 unrouted)
  Top 0.305: R39.1 v41.27,92.71 | v46.99,92.71 R35.1 | R43.1 C24.2 v40.01,79.38 LED8.K | v88.58,15.24 IC1.2 88.58,17.78 88.38,17.98 | v88.58,12.7 88.58,12.59 C1.2 | C18.1 53.98,59.05 55.72,59.05 U1.99 | U1.49 81.32,49.01 C11.1 v83.82,50.16 C16.1 | 80.69,49.71 79.19,51.2 79.19,51.47 81.39,53.67 | U1.20 61.59,38.23 v61.59,36.83 | U1.27 73.03,41.75 73.03,40.64 72.07,39.69 C12.1 | C10.1 v61.59,36.83 | U1.74 74.41,63.77 C17.1 74.3,65.41 72.91,66.79 C20.1 | C6.1 R10.2 | 67.97,83.82 67.97,82.58 67.94,82.55 67.97,82.52 67.97,80.64 | C5.1 62.34,74.3 65.41,74.3 67.23,76.12 SW2.2-1 | LED6.K v40.01,75.56 | R78.1 v49.53,56.52 | C7.1 C8.1 48.15,43.81 | U1.10 60.74,44.45 53.98,44.45 51.95,46.47 C15.1 51.32,46.35 50.8,46.35 50.48,46.04 50.48,45.4 50.16,45.09 49.65,45.09 C21.2 49.3,44.97 48.15,43.81 | LED5.K v40.01,29.21 | C13.1 65.29,37.35 64.77,36.83 v61.59,36.83 | 48.15,43.81 v47.62,43.81 | PD2.19 PD2.20
  Top 0.406: PD3.18 PD3.20 | 18.66,61.59 18.41,61.59 18.59,61.77 PD3.26 18.66,61.59 | 18.66,61.59 19.05,61.59 19.05,60.98 PD3.27 | S1.1 S1.2 S1.3 S1.4 S1.5 S1.6 S1.7 S1.8 | SW3.2-1 67.97,83.82 SW3.2-2 68.05,88.9 | SW2.2-1 67.97,80.64 SW2.2-2 | C30.2 R75.1 R91.1 LED12.K | R79.1 R69.1 v47.62,10.16 | R42.1 C23.2 v40.01,33.02 LED7.K | v47.62,33.02 R36.1 | C29.2 R74.1 | R47.1 R37.1 v47.62,79.38 | v47.62,56.52 R68.1 47.96,57.9 | R34.1 v45.72,47.62 | R38.1 v40.01,48.9 | v40.01,71.44 R70.1 | LED9.K v40.01,52.7 | LED10.K C33.2
  Top 0.61: J1.3 J1.5
  Bottom 0.305: v88.58,15.24 v88.58,12.7 | v40.01,71.44 v40.01,75.56 v40.01,79.38 40.01,91.44 v41.27,92.71 | 40.01,33.66 v40.01,33.02 | v49.53,56.52 v47.62,56.52
  Bottom 0.406: 47.62,9.53 v47.62,10.16 | v47.62,43.81 46.35,43.81 45.72,44.45 v45.72,47.62 | 40.01,33.66 v40.01,48.9 v40.01,52.7 v40.01,71.44 | 40.64,9.53 40.01,10.16 v40.01,29.21 v40.01,33.02
  other vias: 14.61,22.23 13.97,88.9 12.7,88.9 11.43,88.9 11.43,87.63 12.7,82.55 11.43,85.09 11.43,83.82 11.43,82.55 12.7,87.63 12.7,85.09 11.43,86.36 12.7,86.36 40.01,56.52 69.22,66.04 69.85,70.48 73.66,68.58 69.22,64.14 73.66,73.66 80.01,74.93 81.28,63.5 84.45,63.5 80.96,61.91 73.03,52.07 68.58,52.07 90.17,83.19 90.17,67.94 90.17,52.07 97.16,96.52 69.85,41.27 71.12,41.27 66.67,36.83 59.37,42.86 55.56,42.86 55.56,38.42 49.53,33.02 56.52,64.77 55.88,65.41 55.88,68.58 56.52,67.94 56.52,70.48 55.88,71.12 56.52,73.03 55.88,74.3 56.52,80.01 52.7,80.01 52.07,79.38 52.07,77.47 52.07,75.56 54.61,75.56 53.98,76.83 52.7,71.12 45.09,77.47 45.09,75.56 45.09,74.3 45.09,73.03 49.53,75.56 49.53,74.3 49.53,78.74 55.88,82.55 52.7,82.55 47.62,66.04 48.58,62.87 46.99,60.33 50.48,60.33 50.16,66.04 55.56,58.74 53.66,56.52 60.01,52.39 46.67,42.86 46.04,39.05 46.67,36.83 48.58,37.15 42.86,37.15 44.77,37.15 40.96,37.15 51.75,26.99 48.58,27.62 46.04,27.62 46.04,19.37 49.85,16.83 51.75,14.29 51.75,20.64 56.83,20.64 56.83,23.18 56.83,9.21 56.83,16.83 80.64,40.64 80.64,38.1 80.64,36.2 80.64,33.02 93.98,60.64 95.57,60.64 53.02,33.97 55.24,35.88 53.02,53.02 50.48,53.02 48.58,53.02 45.09,50.8 44.13,53.66 44.77,60.01 42.86,60.01 48.58,60.33 46.99,85.72 46.35,83.82 48.58,83.19 44.13,83.82 77.47,35.56 75.25,19.05 15.24,87.63 13.97,87.63 14.61,15.88 17.14,24.77 15.88,24.77 14.61,24.77 13.34,24.77 12.06,24.77 12.06,23.5 12.06,22.23 12.06,20.95 12.06,19.68 12.06,18.41 12.06,17.14 12.06,15.88 12.06,14.61 17.14,23.5 17.14,22.23 17.14,20.95 17.14,19.68 17.14,18.41 15.88,19.68 17.14,17.14 17.14,15.88 17.14,14.61 17.14,13.34 15.88,13.34 14.61,13.34 13.34,13.34 12.06,13.34 15.88,18.41 14.61,19.68 14.61,18.41 13.34,18.41 13.34,19.68 24.13,5.08 12.7,83.82 13.97,83.82 13.97,85.09 13.97,86.36 15.24,86.36 15.24,82.55 13.97,82.55 16.51,82.55 16.51,83.82 15.24,83.82 15.24,85.09 15.24,88.9 16.51,85.09 16.51,86.36 16.51,87.63 16.51,88.9 11.43,90.17 12.7,90.17 13.97,90.17 15.24,90.17 16.51,90.17 16.51,91.44 15.24,91.44 13.97,91.44 13.97,92.71 15.24,92.71 16.51,92.71 11.43,92.71 11.43,91.44 12.7,91.44 12.7,92.71 11.43,70.48 12.7,70.48 13.97,70.48 15.24,70.48 16.51,70.48 16.51,69.22 15.24,69.22 13.97,69.22 12.7,69.22 11.43,69.22 11.43,67.94 12.7,67.94 13.97,67.94 15.24,67.94 16.51,67.94 16.51,66.67 15.24,66.67 13.97,66.67 12.7,66.67 11.43,66.67 11.43,65.41 11.43,60.33 11.43,61.59 11.43,62.87 11.43,64.14 12.7,60.33 13.97,60.33 15.24,60.33 16.51,60.33 16.51,61.59 15.24,61.59 13.97,61.59 12.7,61.59 12.7,62.87 13.97,62.87 13.97,64.14 13.97,65.41 12.7,65.41 12.7,64.14 15.24,65.41 15.24,64.14 15.24,62.87 16.51,62.87 16.51,64.14 16.51,65.41
  pour Top (rank 6): -0.64,100.33 0,0 99.06,0 99.69,100.97
  pour Bottom (rank 6): 0,0 99.06,0 99.06,100.33 0,101.6
M1M  (via drill 4)
  other vias: 6.99,90.81
  pour Top (rank 3): 0.64,98.42 0.64,87.63 10.16,87.63 10.16,93.98 20.95,93.98 20.95,90.17 17.46,90.17 17.46,88.58 27.3,88.58 27.3,96.52 35.56,96.52 35.56,93.98 38.42,93.98 38.42,98.42
M1P  (via drill 4)
  other vias: 6.99,83.82
  pour Top (rank 2): 38.42,76.83 38.42,81.28 35.24,81.28 35.56,78.74 27.3,78.74 27.3,86.68 21.91,86.68 21.91,86.36 17.46,86.36 17.46,85.41 20.95,84.77 20.95,80.64 10.16,80.64 10.16,87 0.64,87 0.64,76.83
M2M  (via drill 4)
  other vias: 6.99,68.58
  pour Top (rank 3): 0.64,65.09 0.64,76.2 38.42,76.2 38.42,71.75 35.56,71.75 35.56,74.3 27.3,74.3 27.3,66.36 17.46,66.36 17.46,67.94 20.95,67.94 20.95,71.75 10.16,71.75 10.16,65.09
M2P  (via drill 4)
  other vias: 6.99,60.96
  pour Top (rank 3): 0.64,64.14 0.64,54.61 38.42,54.61 38.42,59.05 35.56,59.05 35.56,56.52 27.3,56.52 27.3,64.45 20.95,64.45 20.95,64.14 17.46,64.14 17.46,63.18 20.95,63.18 20.95,59.05 10.16,59.05 10.16,64.14
M3M  (via drill 4)  (2 unrouted)
  other vias: 6.35,45.09
  pour Top (rank 2): 0.64,53.98 38.1,53.98 38.1,48.9 27.94,48.9 27.94,42.55 20.95,42.55 20.95,48.9 10.16,48.9
M3P  (via drill 4)  (3 unrouted)
  other vias: 6.99,38.1
  pour Top (rank 2): 3.81,34.29 38.1,33.02 38.1,35.56 27.3,35.56 27.94,41.91 20.95,41.91 20.95,36.2 10.16,36.2
M4M  (via drill 4)
  Top 0.61: PD4.21 22.62,21.05 PD4.OUTB#PAD
  other vias: 6.99,22.23
  pour Top: 0,19.05 0,30.48 38.1,30.48 38.1,26.04 27.94,26.04 27.94,19.68 20.64,19.68 20.64,26.04 10.16,26.04 10.16,19.05
M4P  (via drill 4)  (2 unrouted)
  Top 0.61: PD4.25 22.62,17.05 PD4.OUTA#PAD
  other vias: 6.99,15.24
  pour Top (rank 2): 0,18.41 10.16,18.54 10.16,12.06 20.64,12.06 20.64,18.73 27.94,18.73 27.94,12.06 38.1,12.06 38.1,8.89 0,8.89
N$1
  Top 0.305: LED6.A R53.1
N$2
  Top 0.406: LED9.A R82.1
N$3
  Top 0.305: R4.1 62.87,79.38 62.84,79.4 SW2.1-2 SW2.1-1
N$4
  Top 0.406: R57.1 LED8.A
N$5
  Top 0.305: LED5.A R49.1
N$6
  Top 0.406: LED10.A R84.1
N$7
  Top 0.61: R1.1 arc-90 74.21,26.7 SW1.1-2 SW1.1-1
N$8
  Top 0.61: C2.2 R1.2 R3.1 R2.2 C2.2
N$9
  Top 0.61: LED1.A R20.1
N$11
  Top 0.61: LED2.A R21.1
N$12
  Top 0.305: R5.1 62.84,87
  Top 0.406: SW3.1-2 62.84,87 62.84,85.09 | 62.84,85.09 SW3.1-1 | 62.72,84.97 62.84,85.09
N$13
  Top 0.61: LED3.A R23.1
N$14
  Top 0.305: LED11.A R85.1
N$15
  Top 0.61: LED4.A R24.1
N$16
  Top 0.406: LED12.A R86.1
N$18
  Top 0.406: LED7.A R54.1
N$19
  Top 0.406: R91.2 R90.1 R92.2
N$20
  Top 0.61: HD1.1 D1.A
N$21
  Top 0.305: U1.73 75.48,64.14 75.48,66.24 C20.2
N$23
  Top 0.305: U1.48 81.37,48.26 83.82,48.26 C11.2
N$24
  Top 0.305: 60.64,34.17 C10.2 | 60.64,34.17 R25.1 | 60.64,34.17 60.64,37.98 U1.19
N$25  (via drill 0.35)
  Top 0.305: U1.21 64.14,40.06 v64.14,37.47
  Top 0.406: IC2.1 82.23,15.24 | 82.23,15.24 82.23,16.82 82.67,17.26 C9.2 | 82.23,15.24 v64.14,15.24
  Top 0.61: C9.2 R22.2
  Bottom 0.305: v64.14,15.24 v64.14,37.47
N$26
  Top 0.406: R29.2 R47.2 49.53,85.09 47.99,86.63 PD2.7
N$29
  Top 0.406: PD3.7 48.62,64.41 49.53,63.5 R78.2 R59.2
N$30
  Top 0.406: PD3.4 40.83,61.41 41.91,60.33 R74.2 R60.2
N$31
  Top 0.406: PD3.10 39.47,67.41 40.01,67.94 R70.2 R61.2
N$32
  Top 0.406: PD3.8 44.45,65.41 45.72,66.67 R66.2 R64.1
N$35  (1 unrouted)
  Top 0.406: 46.72,40.91 49.53,38.1 R46.2 R26.2
N$36  (1 unrouted)
  Top 0.406: 41.47,37.91 41.91,37.47 R42.2 R27.2
N$37  (1 unrouted)
  Top 0.406: R38.2 R28.2
N$38
  Top 0.406: PD2.4 41.47,83.63 41.91,83.19 R43.2 R30.2
N$39
  Top 0.406: PD2.10 40.85,89.63 R39.2 R31.2
N$40  (1 unrouted)
  Top 0.406: 44.45,41.91 45.72,43.18 R34.2 R32.1
N$43
  Top 0.406: PD4.7 46.62,18.05 49.53,15.24 R79.2 R62.2
N$44
  Top 0.406: PD4.4 40.83,15.05 41.91,13.97 R75.2 R63.2
N$45
  Top 0.406: PD4.10 39.47,21.05 40.01,21.59 R71.2 R58.2
N$46
  Top 0.406: PD4.8 44.45,19.05 45.72,20.32 R67.2 R65.1
N$52
  Top 0.406: PD2.8 46.35,87.63 46.99,88.27 R35.2 R33.1
N$56
  Top 0.305: R8.2 R5.2 R14.1 C4.2
N$66
  Top 0.305: R9.2 R4.2 R16.1 C5.2
N$67
  Top 0.305: RV1.3 RV1.2 C6.2 | C6.2 R10.1 | R19.1 C6.2
NRST@SYS  (via drill 0.35)
  Top 0.305: R14.2 60.33,84.34 60.33,82.55 60.01,82.23 58.1,82.23 57.78,81.92 v57.78,74.3 | v58.42,40.01 59.13,40.01 U1.14
  Bottom 0.305: v57.78,74.3 57.78,70.48 58.42,69.85 v58.42,40.01
P1@PWM  (via drill 0.35)
  Top 0.305: R29.1 51.44,79.38 v51.44,74.3 | U1.95 53.34,64.27 v53.34,72.39
  Bottom 0.305: v51.44,74.3 52.7,74.3 53.34,73.66 v53.34,72.39
P2@PWM  (via drill 0.35)
  Top 0.305: R59.1 v51.44,56.52 | U1.96 52.7,64.14 v52.7,64.77
  Bottom 0.305: v51.44,56.52 51.44,63.5 v52.7,64.77
P3@PWM  (via drill 0.35)
  Top 0.305: 62.1,49.4 U1.5 62.1,49.4 60.33,47.62 57.15,47.62 53.98,50.8 v51.44,50.8 | R26.1 v51.44,33.02
  Bottom 0.305: v51.44,33.02 51.44,46.66 51.39,47.98 51.39,48.85 51.44,50.16 v51.44,50.8
P4@PWM  (via drill 0.35)
  Top 0.305: U1.4 60.31,48.26 57.78,48.26 54.61,51.44 v50.8,51.44 | v50.8,10.16 51.44,10.79 R62.1
  Bottom 0.305: v50.8,51.44 v50.8,10.16
RTS2@UART  (via drill 0.35)
  Top 0.305: v60.96,64.77 60.96,63.72 U1.85
  Bottom 0.305: HD2.5 65.41,90.81 66.67,89.53 66.67,64.35 65.83,63.5 61.28,63.5 60.96,63.82 v60.96,64.77
RX1@UART  (via drill 0.35)
  Top 0.305: U1.26 72.39,41.68 72.39,41.27 71.12,40.01 v71.12,36.83
  Bottom 0.305: v71.12,36.83 71.12,9.53 71.75,8.89 78.11,8.89 78.74,8.26 HD1.3
RX2@UART  (via drill 0.35)
  Top 0.305: 65.27,57.92 U1.87 59.69,63.57 v59.69,64.77 | HD2.6 66.67,92.71 v69.85,92.71
  Bottom 0.305: v69.85,92.71 69.85,74.3 67.94,72.39 67.94,63.5 67.31,62.87 66.67,62.23 60.96,62.23 60.78,62.41 60.77,62.41 60.32,62.86 59.87,63.31 59.87,63.32 59.69,63.5 v59.69,64.77
RXSTA  (via drill 0.35)
  Top 0.305: U1.53 81.37,55.88 v83.19,55.88 | v86.36,52.7 89.53,49.53 92.08,49.53 92.71,48.9 R21.2
  Bottom 0.305: v83.19,55.88 v86.36,52.7
SA0  (via drill 0.35)
  Top 0.305: U1.68 75.25,60.37 v75.25,60.64 | v74.93,93.98 79.38,93.98
  Top 0.406: 79.38,93.98 S1.16 R6.1
  Bottom 0.305: v74.93,93.98 74.93,60.97 75.25,60.65 v75.25,60.64
SA1  (via drill 0.35)
  Top 0.305: U1.67 75.88,60.3 v75.88,61.28 | v75.56,91.44 79.38,91.44
  Top 0.406: 79.38,91.44 S1.15 R7.1
  Bottom 0.305: v75.88,61.28 75.56,61.59 v75.56,91.44
SA2  (via drill 0.35)
  Top 0.305: U1.66 76.52,60.22 v76.52,61.91 | v76.2,88.9 80.64,88.9
  Top 0.406: S1.14 80.64,88.9 R11.1
  Bottom 0.305: v76.52,61.91 76.2,62.23 v76.2,88.9
SA3  (via drill 0.35)
  Top 0.305: U1.65 77.15,60.15 v77.15,61.28 | v76.83,86.36 79.38,86.36
  Top 0.406: 79.38,86.36 S1.13 R12.1
  Bottom 0.305: v77.15,61.28 77.15,62.55 76.83,62.87 v76.83,86.36
SB0  (via drill 0.35)
  Top 0.305: U1.62 76.33,57.27 79.2,60.14 79.2,60.15 79.38,60.33 v79.38,60.96 | v77.47,83.82 80.64,83.82
  Top 0.406: S1.12 80.64,83.82 R13.1
  Bottom 0.305: v79.38,60.96 79.38,61.59 77.47,63.5 v77.47,83.82
SB1  (via drill 0.35)
  Top 0.305: U1.61 80.01,60.18 v80.01,61.59 | S1.11 v78.11,81.28
  Top 0.406: S1.11 R15.1
  Bottom 0.305: v80.01,61.59 80.01,73.03 78.11,74.93 v78.11,81.28
SW0  (via drill 0.35)
  Top 0.305: 60.96,77.47 R16.2 60.64,77.47 60.33,77.15 60.33,74.61 60.01,74.3 v59.69,74.3 v59.69,74.29 | U1.91 57.15,63.28 57.15,67.94 59.69,70.48 v59.69,73.03
  Bottom 0.305: v59.69,74.29 v59.69,73.03
SW1
  Top 0.305: U1.47 79.19,49.67 84.91,43.95 84.91,40.45 84.45,39.99 84.45,29.21 82.55,27.3 76.83,27.3 R3.2
TCK
  Top 0.305: J1.4 65.41,71.12 66.04,70.48 66.04,66.36 66.36,66.04 67.94,66.04 68.58,65.41 68.58,62.46 U1.76
TDI
  Top 0.305: U1.77 67.94,62.39 67.94,64.77 67.13,65.58 66.17,65.58 65.71,66.04 61.59,66.04 60.96,66.67 60.96,67.94 61.59,68.58 J1.8
TDO
  Top 0.305: U1.89 58.42,63.43 58.42,66.04 59.69,67.31 59.69,69.53 60.01,69.85 J1.6
TMS
  Top 0.305: 72.8,60.73 U1.72 71.74,59.69 71.12,59.69 70.48,60.33 70.48,73.03 69.85,73.66 66.67,73.66 65.41,72.39 J1.2
TRST  (via drill 0.35)
  Top 0.305: J1.10 v61.59,67.31 | U1.90 57.78,63.36 57.78,66.67 v59.05,67.94
  Bottom 0.305: v59.05,67.94 59.69,67.31 v61.59,67.31
TX1@UART  (via drill 0.35)
  Top 0.305: U1.25 68.58,41.68 68.58,41.27 69.85,40.01 v69.85,36.83
  Bottom 0.305: HD1.4 70.48,6.35 69.85,6.99 v69.85,36.83
TX2@UART  (via drill 0.35)
  Top 0.305: v60.33,64.14 60.33,63.64 U1.86
  Bottom 0.305: HD2.8 69.22,92.71 69.22,74.93 67.31,73.03 67.31,64.14 66.04,62.87 60.96,62.87 60.33,63.5 v60.33,64.14
TXSTA  (via drill 0.35)
  Top 0.305: U1.54 81.29,56.52 v83.82,56.52 | v86.36,53.98 90.17,50.16 92.71,50.16 93.34,49.53 93.34,31.23 R20.2
  Bottom 0.305: v83.82,56.52 v86.36,53.98
USB_VBUS
  Top 0.305: X1.1 89.84,10.49 89.53,10.79 86.36,10.79 85.72,11.43 D2.A
V+  (via drill 0.35, 1 pad 1, 4)  (5 unrouted)
  Top 0.305: PD4.3 v34.92,14.61 | R90.2 40.01,10.13 39.3,10.84 39.3,11.79 40.01,12.5 40.01,13.34
  Top 0.406: PD4.13 PD4.12 35.37,23.05 v34.92,23.5 | 37.47,13.97 37.12,13.97 PD4.3 37.04,13.97 39.37,13.97 40.01,13.34 C30.1 | v34.92,23.5 v34.92,25.4 v33.02,25.4 v31.11,25.4 v29.21,25.4 | v34.92,23.5 v34.92,21.59 32.38,19.05 PD4.VCC#PAD | v34.92,16.51 v34.92,14.61 v34.92,12.7 v33.02,12.7 v31.11,12.7 v29.21,12.7 | C24.1 39.41,82.63 PD2.3 34.53,82.63 v34.29,82.87 | C29.1 39.41,60.41 PD3.3 | 39.29,36.91 40.01,36.2 C23.1 | 39.77,9.01 R90.2 | PD2.23 PD2.VCC#PAD | PD2.13 34.53,92.63 v34.29,92.39
  Top 0.61: PD4.VCC#PAD PD4.23
  other vias: 32.38,5.08 28.57,81.28 29.21,80.64 29.84,81.28 29.21,81.92 30.48,80.64 30.48,81.92 31.11,81.28 31.75,81.92 31.75,80.64 32.38,81.28 33.02,80.64 33.02,81.92 33.66,81.28 34.29,80.64 34.29,81.92 34.29,83.82 34.29,84.77 29.21,93.34 29.21,94.61 29.84,93.98 30.48,94.61 30.48,93.34 31.11,93.98 31.75,94.61 31.75,93.34 32.38,93.98 33.02,93.34 33.02,94.61 33.66,93.98 34.29,94.61 34.29,93.34 34.29,91.44 34.29,90.49 34.29,89.53 34.29,88.58 34.29,87.63 34.29,86.68 34.29,85.72 29.84,95.25 31.11,95.25 32.38,95.25 33.66,95.25 28.57,80.01 29.84,80.01 31.11,80.01 32.38,80.01 33.66,80.01 28.57,95.25 28.57,93.98 29.21,71.12 28.57,71.75 29.21,72.39 28.57,73.03 29.84,73.03 30.48,72.39 29.84,71.75 30.48,71.12 31.11,71.75 31.75,71.12 31.75,72.39 31.11,73.03 32.38,73.03 32.38,71.75 33.02,71.12 33.02,72.39 33.66,73.03 33.66,71.75 34.29,72.39 34.29,71.12 34.29,70.17 34.29,69.22 34.29,68.26 34.29,67.31 34.29,66.36 34.29,65.41 34.29,64.45 34.29,63.5 34.29,62.55 34.29,61.59 34.29,60.64 34.29,59.69 34.29,58.42 33.66,59.05 33.02,59.69 33.02,58.42 32.38,59.05 31.75,59.69 31.75,58.42 31.11,59.05 30.48,59.69 30.48,58.42 31.11,57.78 32.38,57.78 33.66,57.78 29.84,59.05 29.84,57.78 29.21,58.42 28.57,57.78 28.57,59.05 29.21,59.69
  pour Top (rank 4): 27.94,73.66 27.94,66.04 17.46,66.04 17.46,64.77 27.94,64.77 27.94,57.15 34.92,57.15 34.92,59.69 38.73,59.69 38.73,60.96 34.92,60.96 34.92,68.58 38.42,68.58 38.42,71.12 34.92,71.12 34.92,73.66
  pour Top (rank 4): 27.94,49.53 27.94,33.66 36.2,33.66 36.2,49.53
  pour Top (rank 4): 27.94,26.67 27.94,11.43 36.2,11.43 36.2,26.67
  pour Bottom (rank 4): 28.57,0 27.94,99.69 38.1,99.06 38.1,75.56 39.37,0
  pour Top (rank 4): 27.94,95.89 27.94,88.27 17.78,88.27 17.78,87 27.94,87 27.94,79.38 38.1,79.38 38.1,95.89
VM@ANA  (via drill 0.35)
  Top 0.305: U1.33 76.83,42.18 76.83,34.92 75.56,33.66 v62.55,33.66 | v57.15,24.13 56.52,24.13 55.88,23.5 55.88,9.53 49.53,3.17 42.55,3.17 41.91,3.81 C33.1
  Top 0.406: C33.1 R92.1
  Bottom 0.305: v62.55,33.66 57.78,33.66 57.15,33.02 v57.15,24.13
VT@ANA  (via drill 0.35)
  Top 0.305: U1.34 77.47,42.26 v77.47,37.47 | v89.53,66.67 v86.71,66.67 | v84.14,66.67 84.57,67.11 R19.2
  Bottom 0.305: v89.53,66.67 89.53,64.77 88.9,64.14 88.9,38.1 88.27,37.47 v77.47,37.47 | v84.14,66.67 v86.71,66.67
X1@ENC  (via drill 0.35)
  Top 0.305: v94.61,91.44 CON1.P$3 | U1.63 78.74,60.33 78.74,61.59 79.69,62.55 v84.77,62.55 | v86.39,62.55 86.71,62.23 v93.98,62.23
  Top 0.406: R48.1 v88.9,91.44 CON1.P$3
  Bottom 0.305: 87.63,76.2 88.27,76.83 88.27,78.11 88.9,78.74 v88.9,91.44 | v84.77,62.55 v86.39,62.55 | v93.98,62.23 94.61,62.87 v94.61,91.44
X2@ENC  (via drill 0.35)
  Top 0.305: U1.59 82.2,60.96 v84.77,60.96
  Top 0.406: R80.1 v88.9,74.93 CON3.P$3
  Bottom 0.305: v88.9,74.93 88.9,65.41 88.27,64.77 88.27,61.91 87.31,60.96 v84.77,60.96
X3@ENC  (via drill 0.35)
  Top 0.305: 87,58.3 R50.1 v88.27,58.42 CON2.P$3 | U1.40 80.64,43.32 v80.64,42.55
  Bottom 0.305: v88.27,58.42 88.27,45.72 85.09,42.55 v80.64,42.55
X4@ENC  (via drill 0.35)
  Top 0.305: U1.23 68.53,42.98 67.31,41.76 67.31,40.01 v68.58,38.73 | R87.1 v88.27,41.91 CON4.P$3
  Top 0.406: 87,41.91 R87.1
  Bottom 0.305: v68.58,38.73 87.63,38.73 88.27,39.37 v88.27,41.91
Y1@ENC  (via drill 0.35)
  Top 0.305: v86.68,64.45 87.31,64.45 87.63,64.77 91.82,64.77 92.45,64.14 93.34,64.14 v93.98,64.77 | v93.98,93.98 89.53,93.98 | U1.64 78.11,60.4 78.11,62.23 80.64,64.77 v84.77,64.77
  Top 0.406: R51.1 v88.9,93.98 89.53,93.98 CON1.P$4
  Bottom 0.305: 87,76.83 87.63,77.47 87.63,78.74 88.27,79.38 88.27,92.08 88.9,92.71 v88.9,93.98 | v84.77,64.77 86.36,64.77 v86.68,64.45 | v93.98,64.77 v93.98,93.98
Y2@ENC  (via drill 0.35)
  Top 0.305: U1.60 82.13,61.59 v84.14,61.59
  Top 0.406: R81.1 v88.9,77.47 CON3.P$4
  Bottom 0.305: v88.9,77.47 88.9,76.2 88.27,75.56 88.27,66.04 87.63,65.41 87.63,62.23 87,61.59 v84.14,61.59
Y3@ENC  (via drill 0.35)
  Top 0.305: 87,60.84 R52.1 v88.27,60.96 CON2.P$4 | v81.92,43.18 81.92,43.47 U1.42
  Bottom 0.305: v81.92,43.18 84.45,43.18 87.63,46.35 87.63,59.05 88.27,59.69 v88.27,60.96
Y4@ENC  (via drill 0.35)
  Top 0.305: U1.24 67.94,41.75 67.94,40.64 v69.22,39.37 | R88.1 v88.27,44.45 CON4.P$4
  Bottom 0.305: v88.27,44.45 88.27,43.18 87.63,42.55 87.63,40.01 87,39.37 v69.22,39.37
Z1  (via drill 0.35)
  Top 0.305: U1.58 82.28,60.33 v82.55,60.33
  Top 0.406: R55.1 v88.9,96.52 CON1.P$5
  Bottom 0.305: v82.55,60.33 82.55,95.89 83.19,96.52 v88.9,96.52
Z2  (via drill 0.35)
  Top 0.305: U1.57 82.35,59.69 v83.19,59.69
  Top 0.406: R83.1 v87.63,80.01 CON3.P$5
  Bottom 0.305: v83.19,59.69 83.19,79.38 83.82,80.01 v87.63,80.01
Z3  (via drill 0.35)
  Top 0.305: 89.53,63.5 CON2.P$5 | 89.53,63.5 R56.1 | U1.56 82.42,59.05 v83.82,59.05 | v87,59.69 93.98,59.69 94.61,60.33 94.61,62.87 93.98,63.5 89.53,63.5
  Bottom 0.305: v83.82,59.05 84.45,59.69 v87,59.69
Z4  (via drill 0.35)
  Top 0.305: U1.55 82.49,58.42 v84.45,58.42 | v87,48.26 87.11,48.15 R89.1
  Top 0.406: R89.1 CON4.P$5
  Bottom 0.305: v84.45,58.42 86.36,58.42 87,57.78 v87,48.26